# EAGLE schematic ESPDRONE2 (1) (EAGLE 7.2.0)
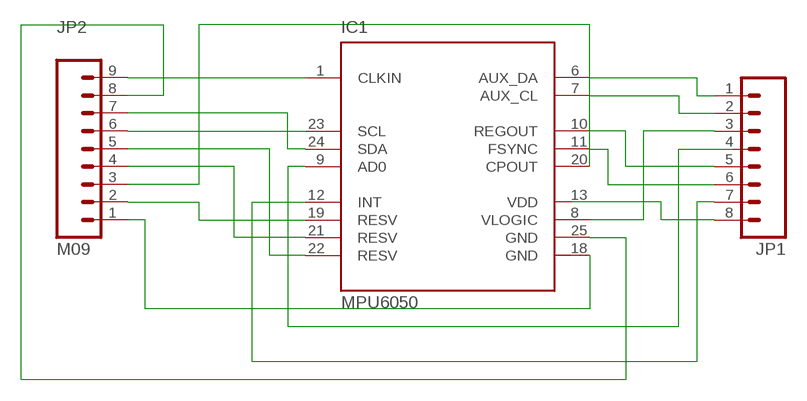
[diagram p0: schematic, sheet 1]

## Parts
IC1  MPU6050  [QFN50P400X400X95-25T265X275N]
JP1  M081X08  [1X08]
JP2  M09  [1X09]

## Nets
N$1: IC1.6(AUX_DA) JP1.1
N$2: IC1.7(AUX_CL) JP1.2
N$3: IC1.8(VLOGIC) JP1.3
N$4: IC1.9(AD0)
N$5: IC1.10(REGOUT) JP1.5
N$6: IC1.11(FSYNC) JP1.6
N$7: IC1.12(INT) JP1.7
N$8: JP1.8
N$9: IC1.18(GND) JP2.1
N$10: IC1.19(RESV) JP2.2
N$11: IC1.20(CPOUT) JP2.3
N$12: IC1.21(RESV) JP2.4
N$13: IC1.22(RESV) JP2.5
N$14: IC1.23(SCL) JP2.6
N$15: IC1.24(SDA) JP2.7
N$16: IC1.25(GND) JP2.8
N$17: IC1.1(CLKIN) JP2.9
Unconnected: IC1.2(NC) IC1.3(NC) IC1.4(NC) IC1.5(NC) IC1.14(NC) IC1.15(NC) IC1.16(NC) IC1.17(NC) JP1.4

## Power pins joined to a net without a drawn wire
VDD: IC1.13(VDD)

## Library data of the parts
IC1 = invensense:MPU6050: The triple-axis MEMS gyroscope
JP1 = SparkFun-Connectors:M08: Header 8 Standard 8-pin 0.1" header. Use with straight break away headers (SKU : PRT-00116), right angle break away headers (PRT-00553), swiss pins (PRT-00743), machine pins (PRT-00117), and female headers (PRT-00115).
JP2 = SparkFun-Connectors:M09: Header 9 Standard 9-pin 0.1" header. Use with straight break away headers (SKU : PRT-00116), right angle break away headers (PRT-00553), swiss pins (PRT-00743), machine pins (PRT-00117), and female headers (PRT-00115).